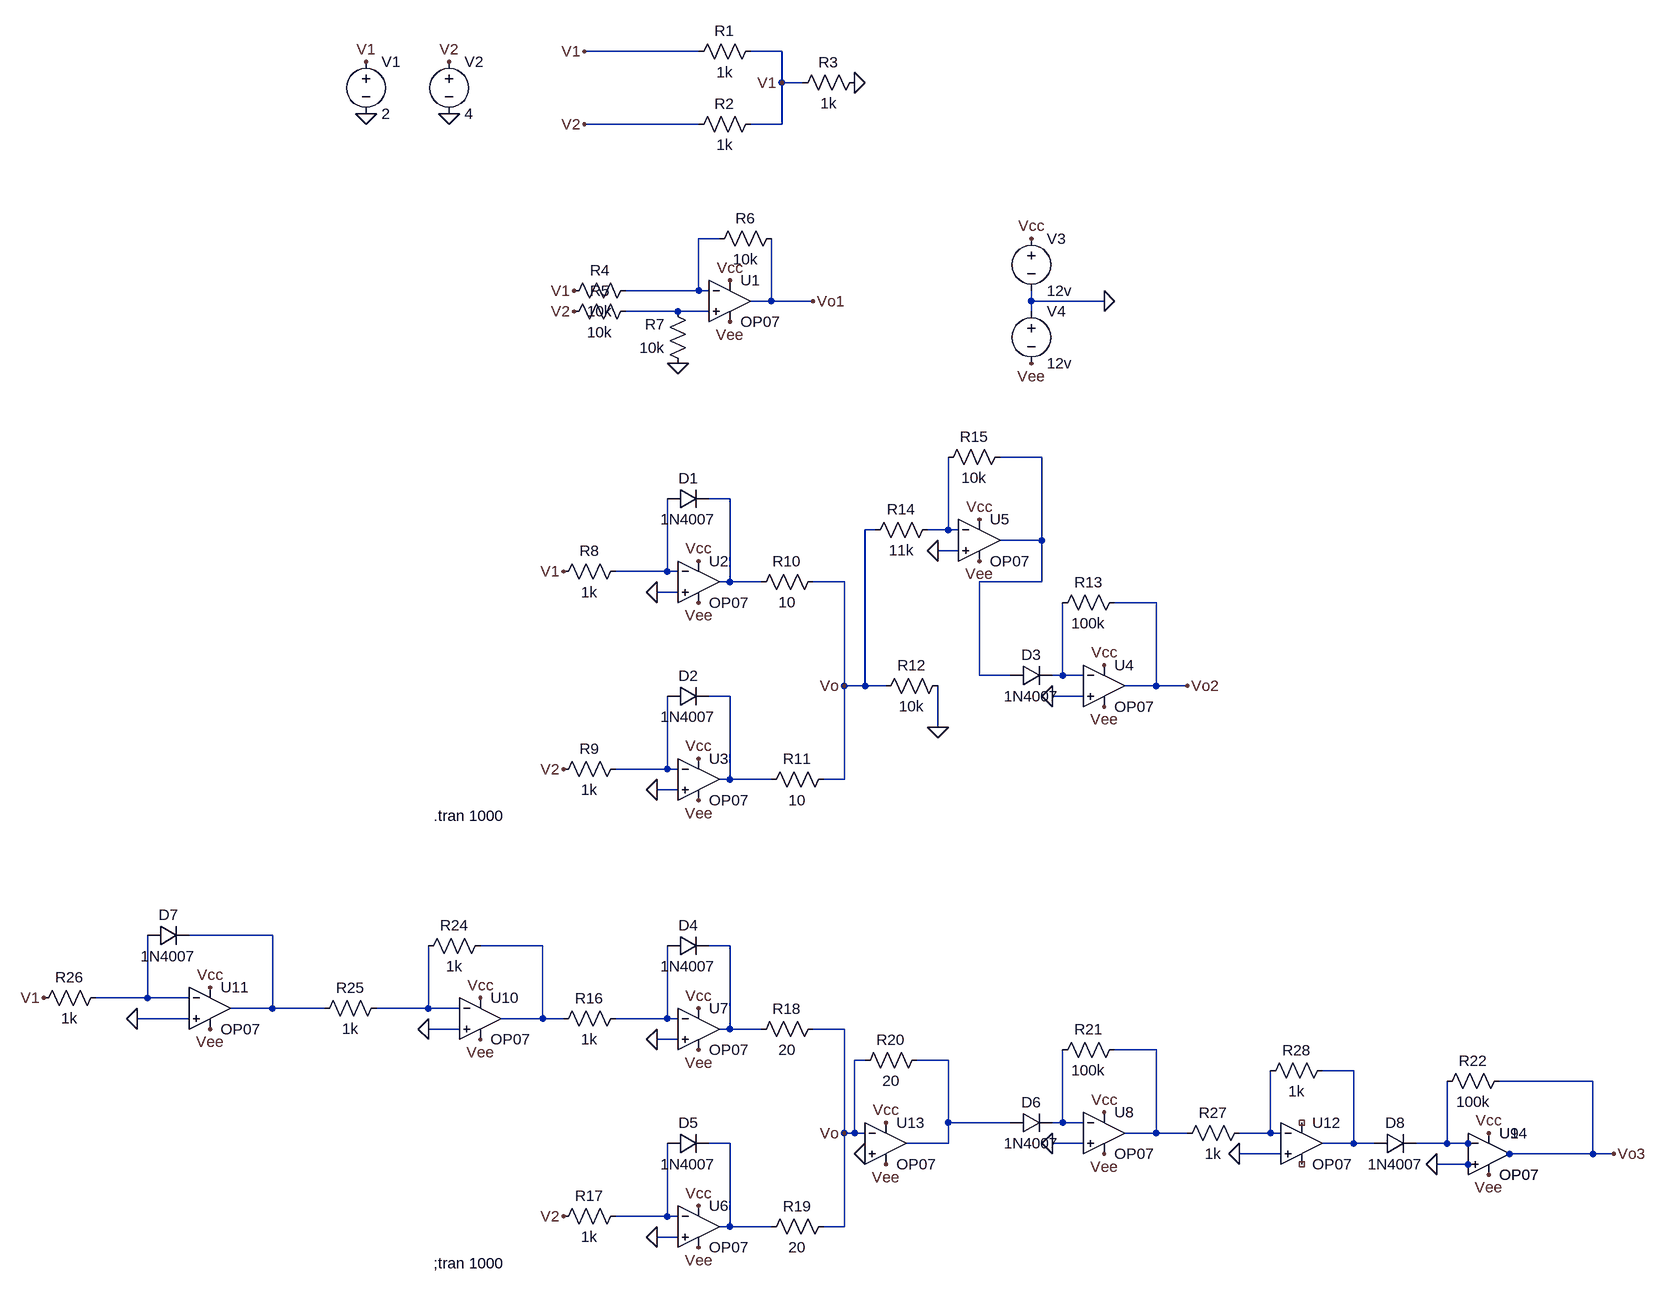
[diagram p0: schematic analog_calculator_simulation.asc]
analog_calculator_simulation.asc, the LTspice schematic file:
Version 4
SHEET 1 1468 2024
WIRE 0 96 -176 96
WIRE 128 96 80 96
WIRE 128 144 128 96
WIRE 160 144 128 144
WIRE 0 208 -176 208
WIRE 128 208 128 144
WIRE 128 208 80 208
WIRE 32 384 0 384
WIRE 0 464 0 384
WIRE 0 464 -112 464
WIRE 16 464 0 464
WIRE 112 480 112 384
WIRE 112 480 80 480
WIRE 176 480 112 480
WIRE 512 480 512 464
WIRE 624 480 512 480
WIRE -32 496 -112 496
WIRE 16 496 -32 496
WIRE 512 496 512 480
WIRE 528 720 464 720
WIRE 48 784 16 784
WIRE 272 832 256 832
WIRE 384 832 384 720
WIRE 384 832 352 832
WIRE 400 832 384 832
WIRE 528 848 528 720
WIRE 528 848 464 848
WIRE 400 864 368 864
WIRE -48 896 -48 784
WIRE -48 896 -128 896
WIRE -32 896 -48 896
WIRE 48 912 48 784
WIRE 48 912 32 912
WIRE 96 912 48 912
WIRE 224 912 176 912
WIRE 528 912 528 848
WIRE 528 912 432 912
WIRE -32 928 -64 928
WIRE 704 944 640 944
WIRE 432 1056 432 912
WIRE 480 1056 432 1056
WIRE 560 1056 560 944
WIRE 560 1056 544 1056
WIRE 592 1056 560 1056
WIRE 224 1072 224 912
WIRE 256 1072 256 832
WIRE 256 1072 224 1072
WIRE 288 1072 256 1072
WIRE 704 1072 704 944
WIRE 704 1072 656 1072
WIRE 752 1072 704 1072
WIRE 48 1088 16 1088
WIRE 592 1088 544 1088
WIRE 368 1136 368 1072
WIRE -48 1200 -48 1088
WIRE -48 1200 -128 1200
WIRE -32 1200 -48 1200
WIRE 48 1216 48 1088
WIRE 48 1216 32 1216
WIRE 112 1216 48 1216
WIRE 224 1216 224 1072
WIRE 224 1216 192 1216
WIRE -32 1232 -64 1232
WIRE -656 1456 -784 1456
WIRE -240 1472 -336 1472
WIRE 48 1472 16 1472
WIRE -848 1552 -848 1456
WIRE -848 1552 -928 1552
WIRE -784 1552 -848 1552
WIRE -656 1568 -656 1456
WIRE -656 1568 -720 1568
WIRE -576 1568 -656 1568
WIRE -416 1568 -416 1472
WIRE -416 1568 -496 1568
WIRE -368 1568 -416 1568
WIRE -784 1584 -864 1584
WIRE -240 1584 -240 1472
WIRE -240 1584 -304 1584
WIRE -208 1584 -240 1584
WIRE -48 1584 -48 1472
WIRE -48 1584 -128 1584
WIRE -32 1584 -48 1584
WIRE -368 1600 -416 1600
WIRE 48 1600 48 1472
WIRE 48 1600 32 1600
WIRE 96 1600 48 1600
WIRE 224 1600 176 1600
WIRE -32 1616 -64 1616
WIRE 704 1632 640 1632
WIRE 256 1648 240 1648
WIRE 384 1648 336 1648
WIRE 1008 1664 960 1664
WIRE 1376 1680 1232 1680
WIRE 384 1744 384 1648
WIRE 480 1744 384 1744
WIRE 560 1744 560 1632
WIRE 560 1744 544 1744
WIRE 592 1744 560 1744
WIRE 224 1760 224 1600
WIRE 240 1760 240 1648
WIRE 240 1760 224 1760
WIRE 256 1760 240 1760
WIRE 704 1760 704 1632
WIRE 704 1760 656 1760
WIRE 752 1760 704 1760
WIRE 880 1760 880 1664
WIRE 880 1760 832 1760
WIRE 896 1760 880 1760
WIRE 48 1776 16 1776
WIRE 384 1776 384 1744
WIRE 384 1776 320 1776
WIRE 592 1776 544 1776
WIRE 1008 1776 1008 1664
WIRE 1008 1776 960 1776
WIRE 1040 1776 1008 1776
WIRE 1152 1776 1152 1680
WIRE 1152 1776 1104 1776
WIRE 1184 1776 1152 1776
WIRE 896 1792 832 1792
WIRE 1376 1792 1376 1680
WIRE 1376 1792 1248 1792
WIRE 1408 1792 1376 1792
WIRE 1184 1808 1136 1808
WIRE -48 1888 -48 1776
WIRE -48 1888 -128 1888
WIRE -32 1888 -48 1888
WIRE 48 1904 48 1776
WIRE 48 1904 32 1904
WIRE 112 1904 48 1904
WIRE 224 1904 224 1760
WIRE 224 1904 192 1904
WIRE -32 1920 -64 1920
FLAG 240 144 0
FLAG -32 576 0
FLAG -192 464 V1
FLAG -192 496 V2
FLAG 624 480 0
FLAG 512 384 Vcc
FLAG 512 576 Vee
FLAG 48 512 Vee
FLAG 48 448 Vcc
FLAG 176 480 Vo1
FLAG -512 112 V1
FLAG -384 112 V2
FLAG -512 192 0
FLAG -384 192 0
FLAG -176 96 V1
FLAG -176 208 V2
FLAG -64 928 0
FLAG -64 1232 0
FLAG 368 1136 0
FLAG -208 896 V1
FLAG -208 1200 V2
FLAG 544 1088 0
FLAG 0 880 Vcc
FLAG 0 1184 Vcc
FLAG 624 1040 Vcc
FLAG 0 944 Vee
FLAG 0 1248 Vee
FLAG 624 1104 Vee
FLAG 752 1072 Vo2
FLAG 224 1072 Vo
FLAG 128 144 V1
FLAG 368 864 0
FLAG 432 816 Vcc
FLAG 432 880 Vee
FLAG -64 1616 0
FLAG -64 1920 0
FLAG -208 1888 V2
FLAG 544 1776 0
FLAG 0 1568 Vcc
FLAG 0 1872 Vcc
FLAG 624 1728 Vcc
FLAG 0 1632 Vee
FLAG 0 1936 Vee
FLAG 624 1792 Vee
FLAG 224 1760 Vo
FLAG -1008 1552 V1
FLAG -752 1536 Vcc
FLAG -336 1552 Vcc
FLAG -752 1600 Vee
FLAG -336 1616 Vee
FLAG -416 1600 0
FLAG -864 1584 0
FLAG 832 1792 0
FLAG 256 1792 0
FLAG 288 1744 Vcc
FLAG 288 1808 Vee
FLAG 1136 1808 0
FLAG 1216 1760 Vcc
FLAG 1216 1824 Vee
FLAG 1408 1792 Vo3
SYMBOL res 96 80 R90
WINDOW 0 0 56 VBottom 2
WINDOW 3 32 56 VTop 2
SYMATTR InstName R1
SYMATTR Value 1k
SYMBOL res 96 192 R90
WINDOW 0 0 56 VBottom 2
WINDOW 3 32 56 VTop 2
SYMATTR InstName R2
SYMATTR Value 1k
SYMBOL res 256 128 R90
WINDOW 0 0 56 VBottom 2
WINDOW 3 32 56 VTop 2
SYMATTR InstName R3
SYMATTR Value 1k
SYMBOL OpAmps\\OP07 48 416 R0
SYMATTR InstName U1
SYMBOL res -96 448 R90
WINDOW 0 0 56 VBottom 2
WINDOW 3 32 56 VTop 2
SYMATTR InstName R4
SYMATTR Value 10k
SYMBOL res -96 480 R90
WINDOW 0 0 56 VBottom 2
WINDOW 3 32 56 VTop 2
SYMATTR InstName R5
SYMATTR Value 10k
SYMBOL res 128 368 R90
WINDOW 0 0 56 VBottom 2
WINDOW 3 32 56 VTop 2
SYMATTR InstName R6
SYMATTR Value 10k
SYMBOL res -16 592 R180
WINDOW 0 36 76 Left 2
WINDOW 3 36 40 Left 2
SYMATTR InstName R7
SYMATTR Value 10k
SYMBOL voltage 512 368 R0
WINDOW 123 0 0 Left 0
WINDOW 39 0 0 Left 0
SYMATTR InstName V3
SYMATTR Value 12v
SYMBOL voltage 512 480 R0
WINDOW 123 0 0 Left 0
WINDOW 39 0 0 Left 0
SYMATTR InstName V4
SYMATTR Value 12v
SYMBOL voltage -512 96 R0
WINDOW 123 0 0 Left 0
WINDOW 39 0 0 Left 0
SYMATTR InstName V1
SYMATTR Value 2
SYMBOL voltage -384 96 R0
WINDOW 123 0 0 Left 0
WINDOW 39 0 0 Left 0
SYMATTR InstName V2
SYMATTR Value 4
SYMBOL res -112 880 R90
WINDOW 0 0 56 VBottom 2
WINDOW 3 32 56 VTop 2
SYMATTR InstName R8
SYMATTR Value 1k
SYMBOL res -112 1184 R90
WINDOW 0 0 56 VBottom 2
WINDOW 3 32 56 VTop 2
SYMATTR InstName R9
SYMATTR Value 1k
SYMBOL OpAmps\\OP07 0 1152 R0
SYMATTR InstName U3
SYMBOL OpAmps\\OP07 0 848 R0
SYMATTR InstName U2
SYMBOL diode -48 800 R270
WINDOW 0 32 32 VTop 2
WINDOW 3 0 32 VBottom 2
SYMATTR InstName D1
SYMATTR Value 1N4007
SYMBOL diode -48 1104 R270
WINDOW 0 32 32 VTop 2
WINDOW 3 0 32 VBottom 2
SYMATTR InstName D2
SYMATTR Value 1N4007
SYMBOL res 192 896 R90
WINDOW 0 0 56 VBottom 2
WINDOW 3 32 56 VTop 2
SYMATTR InstName R10
SYMATTR Value 10
SYMBOL res 208 1200 R90
WINDOW 0 0 56 VBottom 2
WINDOW 3 32 56 VTop 2
SYMATTR InstName R11
SYMATTR Value 10
SYMBOL res 384 1056 R90
WINDOW 0 0 56 VBottom 2
WINDOW 3 32 56 VTop 2
SYMATTR InstName R12
SYMATTR Value 10k
SYMBOL diode 480 1072 R270
WINDOW 0 32 32 VTop 2
WINDOW 3 0 32 VBottom 2
SYMATTR InstName D3
SYMATTR Value 1N4007
SYMBOL OpAmps\\OP07 624 1008 R0
SYMATTR InstName U4
SYMBOL res 656 928 R90
WINDOW 0 0 56 VBottom 2
WINDOW 3 32 56 VTop 2
SYMATTR InstName R13
SYMATTR Value 100k
SYMBOL res 368 816 R90
WINDOW 0 0 56 VBottom 2
WINDOW 3 32 56 VTop 2
SYMATTR InstName R14
SYMATTR Value 11k
SYMBOL OpAmps\\OP07 432 784 R0
SYMATTR InstName U5
SYMBOL res 480 704 R90
WINDOW 0 0 56 VBottom 2
WINDOW 3 32 56 VTop 2
SYMATTR InstName R15
SYMATTR Value 10k
SYMBOL res -112 1568 R90
WINDOW 0 0 56 VBottom 2
WINDOW 3 32 56 VTop 2
SYMATTR InstName R16
SYMATTR Value 1k
SYMBOL res -112 1872 R90
WINDOW 0 0 56 VBottom 2
WINDOW 3 32 56 VTop 2
SYMATTR InstName R17
SYMATTR Value 1k
SYMBOL OpAmps\\OP07 0 1840 R0
SYMATTR InstName U6
SYMBOL OpAmps\\OP07 0 1536 R0
SYMATTR InstName U7
SYMBOL diode -48 1488 R270
WINDOW 0 32 32 VTop 2
WINDOW 3 0 32 VBottom 2
SYMATTR InstName D4
SYMATTR Value 1N4007
SYMBOL diode -48 1792 R270
WINDOW 0 32 32 VTop 2
WINDOW 3 0 32 VBottom 2
SYMATTR InstName D5
SYMATTR Value 1N4007
SYMBOL res 192 1584 R90
WINDOW 0 0 56 VBottom 2
WINDOW 3 32 56 VTop 2
SYMATTR InstName R18
SYMATTR Value 20
SYMBOL res 208 1888 R90
WINDOW 0 0 56 VBottom 2
WINDOW 3 32 56 VTop 2
SYMATTR InstName R19
SYMATTR Value 20
SYMBOL diode 480 1760 R270
WINDOW 0 32 32 VTop 2
WINDOW 3 0 32 VBottom 2
SYMATTR InstName D6
SYMATTR Value 1N4007
SYMBOL OpAmps\\OP07 624 1696 R0
SYMATTR InstName U8
SYMBOL res 656 1616 R90
WINDOW 0 0 56 VBottom 2
WINDOW 3 32 56 VTop 2
SYMATTR InstName R21
SYMATTR Value 100k
SYMBOL OpAmps\\OP07 -336 1520 R0
SYMATTR InstName U10
SYMBOL res -320 1456 R90
WINDOW 0 0 56 VBottom 2
WINDOW 3 32 56 VTop 2
SYMATTR InstName R24
SYMATTR Value 1k
SYMBOL res -480 1552 R90
WINDOW 0 0 56 VBottom 2
WINDOW 3 32 56 VTop 2
SYMATTR InstName R25
SYMATTR Value 1k
SYMBOL OpAmps\\OP07 -752 1504 R0
SYMATTR InstName U11
SYMBOL res -912 1536 R90
WINDOW 0 0 56 VBottom 2
WINDOW 3 32 56 VTop 2
SYMATTR InstName R26
SYMATTR Value 1k
SYMBOL diode -848 1472 R270
WINDOW 0 32 32 VTop 2
WINDOW 3 0 32 VBottom 2
SYMATTR InstName D7
SYMATTR Value 1N4007
SYMBOL res 848 1744 R90
WINDOW 0 0 56 VBottom 2
WINDOW 3 32 56 VTop 2
SYMATTR InstName R27
SYMATTR Value 1k
SYMBOL OpAmps\\OP07 928 1712 R0
SYMATTR InstName U12
SYMBOL res 976 1648 R90
WINDOW 0 0 56 VBottom 2
WINDOW 3 32 56 VTop 2
SYMATTR InstName R28
SYMATTR Value 1k
SYMBOL OpAmps\\OP07 288 1712 R0
SYMATTR InstName U13
SYMBOL res 352 1632 R90
WINDOW 0 0 56 VBottom 2
WINDOW 3 32 56 VTop 2
SYMATTR InstName R20
SYMATTR Value 20
SYMBOL diode 1040 1792 R270
WINDOW 0 32 32 VTop 2
WINDOW 3 0 32 VBottom 2
SYMATTR InstName D8
SYMATTR Value 1N4007
SYMBOL OpAmps\\OP07 1216 1728 R0
SYMATTR InstName U9
SYMBOL OpAmps\\OP07 1216 1728 R0
SYMATTR InstName U14
SYMBOL res 1248 1664 R90
WINDOW 0 0 56 VBottom 2
WINDOW 3 32 56 VTop 2
SYMATTR InstName R22
SYMATTR Value 100k
TEXT -408 1272 Left 2 !.tran 1000
TEXT -408 1960 Left 2 !;tran 1000

The netlist it stands for:
* analog_calculator_simulation.asc
R1 V1 V1 1k
R2 V1 V2 1k
R3 0 V1 1k
XU1 N002 N001 Vcc Vee Vo1 LT1001  ; OP07, pins In+ In- V+ V- OUT
R4 N001 V1 10k
R5 N002 V2 10k
R6 Vo1 N001 10k
R7 0 N002 10k
V3 Vcc 0 12v
V4 0 Vee 12v
V1 V1 0 2
V2 V2 0 4
R8 N006 V1 1k
R9 N009 V2 1k
XU3 0 N009 Vcc Vee N008 LT1001  ; OP07, pins In+ In- V+ V- OUT
XU2 0 N006 Vcc Vee N004 LT1001  ; OP07, pins In+ In- V+ V- OUT
D1 N006 N004 1N4007
D2 N009 N008 1N4007
R10 Vo N004 10
R11 Vo N008 10
R12 0 Vo 10k
D3 N003 N007 1N4007
XU4 0 N007 Vcc Vee Vo2 LT1001  ; OP07, pins In+ In- V+ V- OUT
R13 Vo2 N007 100k
R14 N005 Vo 11k
XU5 0 N005 Vcc Vee N003 LT1001  ; OP07, pins In+ In- V+ V- OUT
R15 N003 N005 10k
R16 N015 N011 1k
R17 N023 V2 1k
XU6 0 N023 Vcc Vee N021 LT1001  ; OP07, pins In+ In- V+ V- OUT
XU7 0 N015 Vcc Vee N012 LT1001  ; OP07, pins In+ In- V+ V- OUT
D4 N015 N012 1N4007
D5 N023 N021 1N4007
R18 Vo N012 20
R19 Vo N021 20
D6 N017 N019 1N4007
XU8 0 N019 Vcc Vee N016 LT1001  ; OP07, pins In+ In- V+ V- OUT
R21 N016 N019 100k
XU10 0 N014 Vcc Vee N011 LT1001  ; OP07, pins In+ In- V+ V- OUT
R24 N011 N014 1k
R25 N014 N010 1k
XU11 0 N013 Vcc Vee N010 LT1001  ; OP07, pins In+ In- V+ V- OUT
R26 N013 V1 1k
D7 N013 N010 1N4007
R27 N020 N016 1k
XU12 0 N020 NC_01 NC_02 N018 LT1001  ; OP07, pins In+ In- V+ V- OUT
R28 N018 N020 1k
XU13 0 Vo Vcc Vee N017 LT1001  ; OP07, pins In+ In- V+ V- OUT
R20 N017 Vo 20
D8 N018 N022 1N4007
XU9 0 N022 Vcc Vee Vo3 LT1001  ; OP07, pins In+ In- V+ V- OUT
XU14 0 N022 Vcc Vee Vo3 LT1001  ; OP07, pins In+ In- V+ V- OUT
R22 Vo3 N022 100k
.model D D
.lib standard.dio
.tran 1000
;tran 1000
.lib LTC.lib
.backanno
.end